# EAGLE design desk_winder (EAGLE 6.5.0)
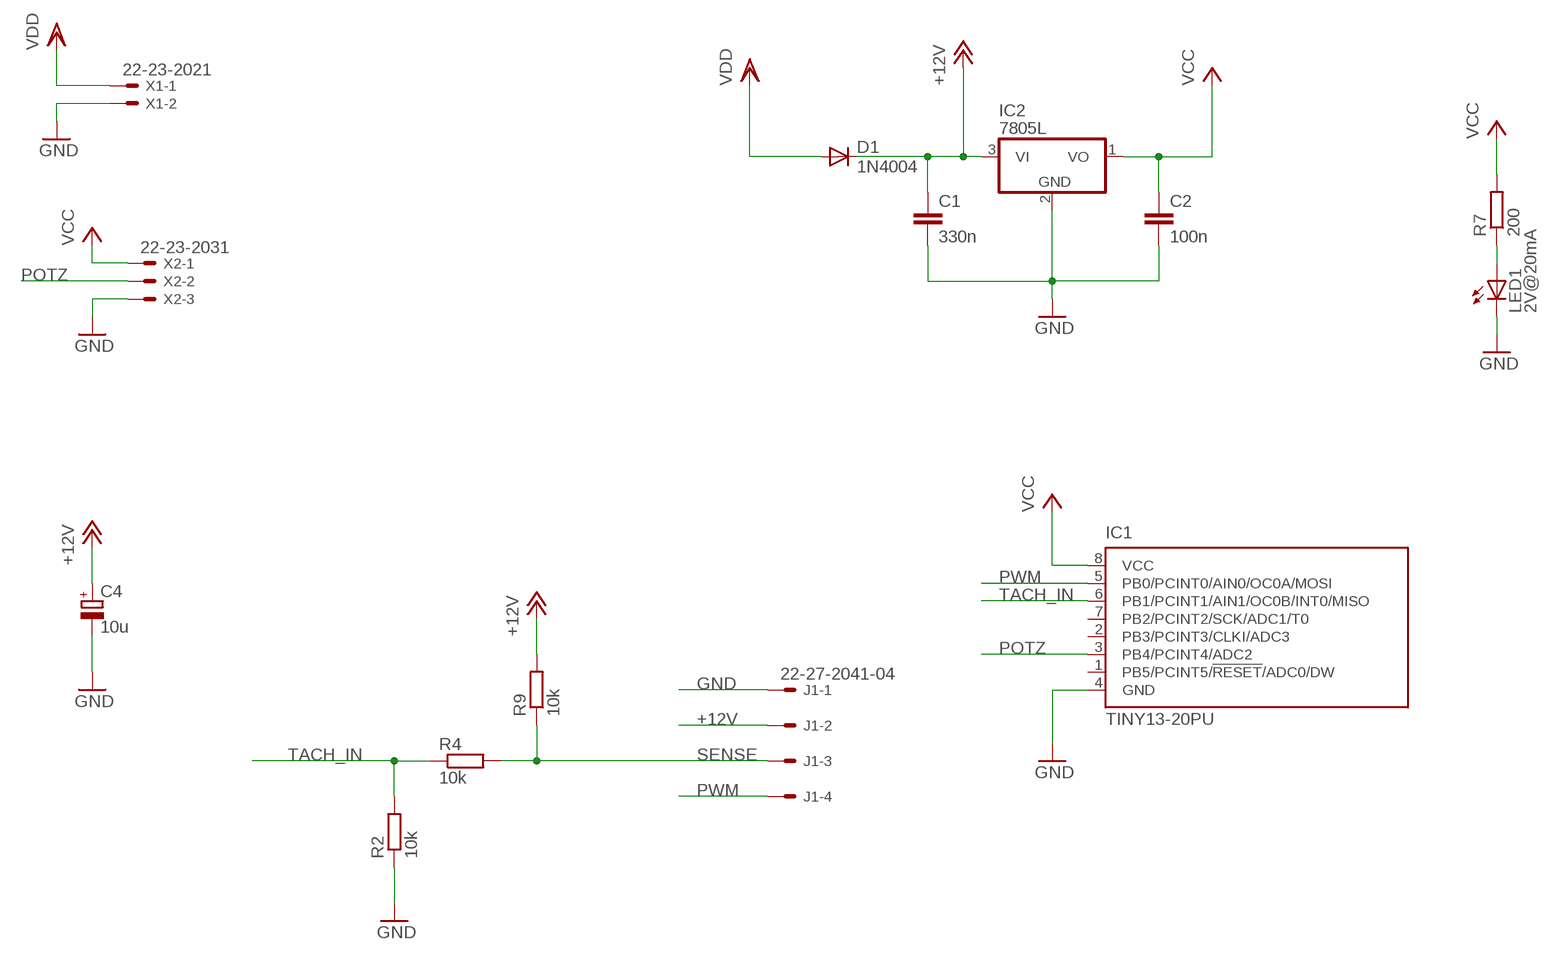
[diagram p0: schematic, sheet 1]

## Parts
C1  330n  C-EU050-025X075  [C050-025X075]
C2  100n  C-EU050-025X075  [C050-025X075]
C4  10u  CPOL-EUE2.5-6  [E2,5-6]
D1  1N4004  [DO41-10]
IC1  TINY13-20PU  [DIL08]
IC2  7805L  [TO92]
J1  22-27-2041-04  [6410-04]
LED1  2V@20mA  LED5MM  [LED5MM]
R2  10k  R-EU_0207/12  [0207/12]
R4  10k  R-EU_0207/12  [0207/12]
R7  200  R-EU_0207/12  [0207/12]
R9  10k  R-EU_0207/12  [0207/12]
X1  22-23-2021  [22-23-2021]
X2  22-23-2031  [22-23-2031]

## Nets
+12V [power]: C1.1 C4.+ D1.C IC2.3(VI) J1.2 R9.2
GND [power]: C1.2 C2.2 C4.- IC1.4(GND) IC2.2(GND) J1.1 LED1.K(C) R2.1 X1.2 X2.3
N$1: LED1.A R7.1
POTZ: IC1.3(PB4/PCINT4/ADC2) X2.2
PWM: IC1.5(PB0/PCINT0/AIN0/OC0A/MOSI) J1.4
SENSE: J1.3 R4.2 R9.1
TACH_IN: IC1.6(PB1/PCINT1/AIN1/OC0B/INT0/MISO) R2.2 R4.1
VCC: C2.1 IC1.8(VCC) IC2.1(VO) R7.2 X2.1
VDD [power]: D1.A X1.1
Unconnected: IC1.1(PB5/PCINT5/!RESET!/ADC0/DW) IC1.2(PB3/PCINT3/CLKI/ADC3) IC1.7(PB2/PCINT2/SCK/ADC1/T0)

## Library data of the parts
C1 C2 = rcl:C-EU: CAPACITOR, European symbol
C4 = rcl:CPOL-EU: POLARIZED CAPACITOR, European symbol
D1 = diode:1N4004: DIODE general purpose rectifier, 1 A
IC1 = atmel:TINY13: 8-bit AVR Microcontroller with 1K Bytes In-System Programmable Flash Source: http://www.atmel.com/dyn/resources/prod_documents/2535S.pdf; MPN: ATTINY13-20PU; OC_FARNELL: 9171550; OC_NEWARK: 96K6521
IC2 = linear:78*: Positive VOLTAGE REGULATOR Source: http://cache.national.com/ds/LM/LM78L05.pdf http://www.fairchildsemi.com/ds/LM/LM7805.pdf
J1 = con-molex:22-?-04: CONNECTOR wire to board 2.54 mm (.1 inch) pitch header; OC_FARNELL: unknown; OC_NEWARK: unknown
LED1 = led:LED: LED OSRAM: - CHIPLED LG R971, LG N971, LY N971, LG Q971, LY Q971, LO R971, LY R971 LH N974, LH R974 LS Q976, LO Q976, LY Q976 LO Q996 - Hyper CHIPLED LW Q18S LB Q993, LB Q99A, LB R99A - SideLED LS A670, LO A670, LY A670, LG A670, LP A670 LB A673, LV A673, LT A673, LW A673 LH A674 LY A675 LS A676, LA A676, LO A676, LY A676, LW A676 LS A679, LY A679, LG A679 - Hyper Micro SIDELED® LS Y876, LA Y876, LO Y876, LY Y876 LT Y87S - SmartLED LW L88C, LW L88S LB L89C, LB L89S, LG L890 LS L89K, LO L89K, LY L89K LS L896, LA L896, LO L896, LY L896 - TOPLED LS T670, LO T670, LY T670, LG T670, LP T670 LSG T670, LSP T670, LSY T670, LOP T670, LYG T670 LG T671, LOG T671, LSG T671 LB T673, LV T673, LT T673, LW T673 LH T674 LS T676, LA T676, LO T676, LY T676, LB T676, LH T676, LSB T676, LW T676 LB T67C, LV T67C, LT T67C, LS T67K, LO T67K, LY T67K, LW E67C LS E67B, LA E67B, LO E67B, LY E67B, LB E67C, LV E67C, LT E67C LW T67C LS T679, LY T679, LG T679 LS T770, LO T770, LY T770, LG T770, LP T770 LB T773, LV T773, LT T773, LW T773 LH T774 LS E675, LA E675, LY E675, LS T675 LS T776, LA T776, LO T776, LY T776, LB T776 LHGB T686 LT T68C, LB T68C - Hyper Mini TOPLED® LB M676 - Mini TOPLED Santana® LG M470 LS M47K, LO M47K, LY M47K Source: http://www.osram.convergy.de LUXEON: - LUMILED® LXK2-PW12-R00, LXK2-PW12-S00, LXK2-PW14-U00, LXK2-PW14-V00 LXK2-PM12-R00, LXK2-PM12-S00, LXK2-PM14-U00 LXK2-PE12-Q00, LXK2-PE12-R00, LXK2-PE12-S00, LXK2-PE14-T00, LXK2-PE14-U00 LXK2-PB12-K00, LXK2-PB12-L00, LXK2-PB12-M00, LXK2-PB14-N00, LXK2-PB14-P00, LXK2-PB14-Q00 LXK2-PR12-L00, LXK2-PR12-M00, LXK2-PR14-Q00, LXK2-PR14-R00 LXK2-PD12-Q00, LXK2-PD12-R00, LXK2-PD12-S00 LXK2-PH12-R00, LXK2-PH12-S00 LXK2-PL12-P00, LXK2-PL12-Q00, LXK2-PL12-R00 Source: www.luxeon.com KINGBRIGHT: KA-3528ASYC Source: www.kingbright.com
R2 R4 R7 R9 = resistor:R-EU_: RESISTOR, European symbol
X1 = con-molex:22-23-2021: .100" (2.54mm) Center Header - 2 Pin; MF: MOLEX; MPN: 22-23-2021; OC_FARNELL: 1462926; OC_NEWARK: 25C3832
X2 = con-molex:22-23-2031: .100" (2.54mm) Center Header - 3 Pin; MF: MOLEX; MPN: 22-23-2031; OC_FARNELL: 1462950; OC_NEWARK: 30C0862

## Net classes
0 default: width 0.406 mm
1 power: width 1.143 mm

## Board
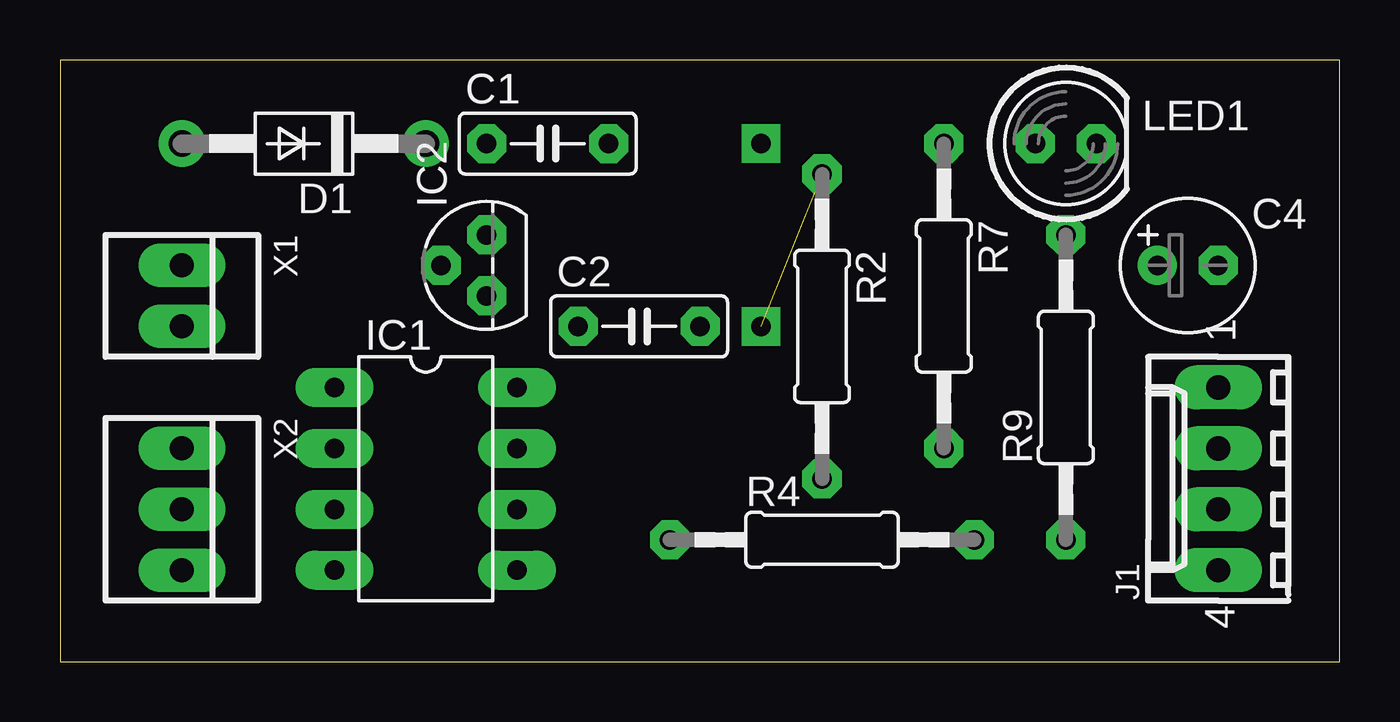
[diagram p1: board, top side]
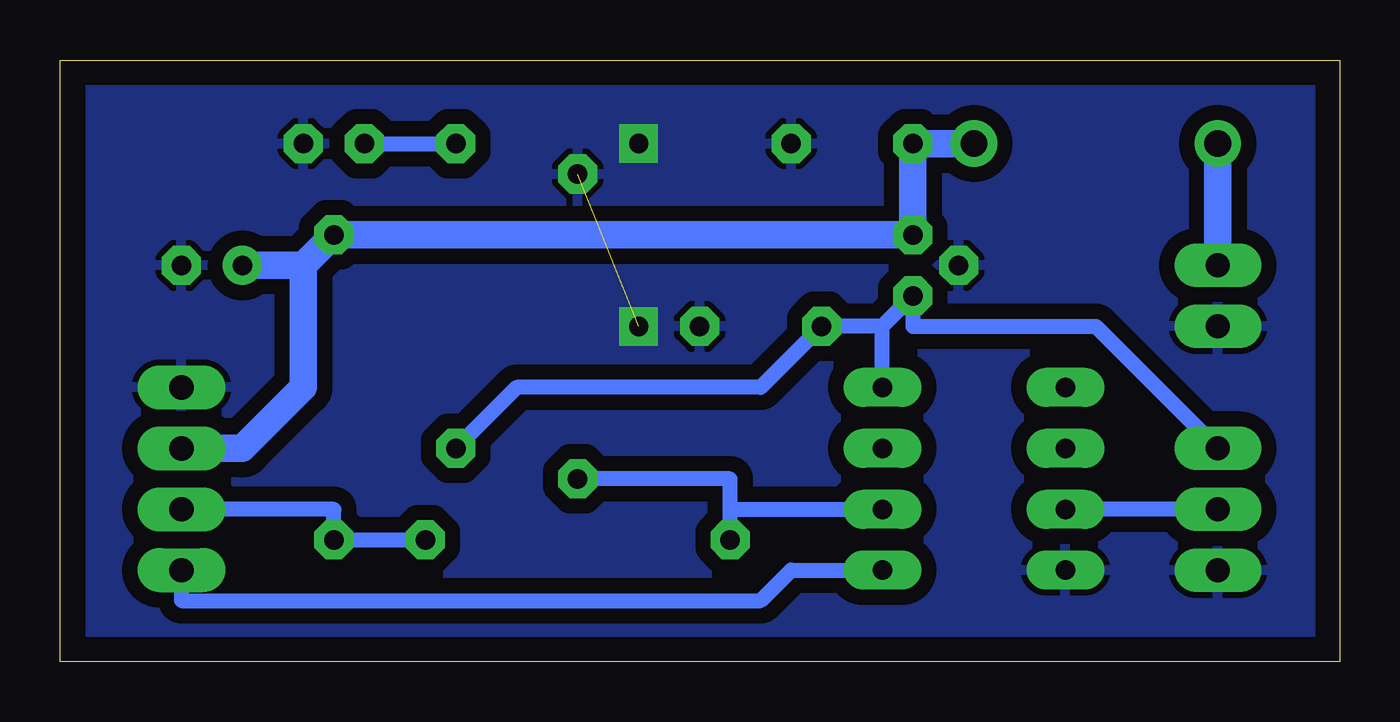
[diagram p2: board, bottom side, seen from below]

Size 53.32 x 25.07 mm. Coordinates in mm from the lower left corner, seen from the top.
Outline: 0,0 53.32,0 53.32,25.07 0,25.07 0,0
Copper layers (1*16): Top 0.035mm / dielectric 1.5mm / Bottom 0.035mm
Design rules "homepcb *": minimum track width 25mil, minimum drill 0.7mm, track to track 25mil, track to pad 25mil, pad to pad 20mil, via to via 10mil, smd to smd 10mil, copper to edge 40mil, drill to drill 10mil, minimum pad ring 16mil, minimum via ring 16mil, stop-mask expansion 0mil, vias tented up to drill 0mil, thermal gap 10mil

### Footprints (pad centres in the part's own frame; a part is rotated, then mirrored left to right if it is on the bottom)
C050-025X075 = drill 0.813 octagon: 1 -2.54,0; 2 2.54,0
E2,5-6 = drill 0.813 pad 1.6: + -1.27,0 | drill 0.813 pad 1.6 octagon: - 1.27,0
DO41-10 = drill 1.118: A 5.08,0; C -5.08,0
DIL08 = drill 0.813 long: 1 -3.81,-3.81; 2 -1.27,-3.81; 3 1.27,-3.81; 4 3.81,-3.81; 5 3.81,3.81; 6 1.27,3.81; 7 -1.27,3.81; 8 -3.81,3.81
TO92 = drill 0.813 octagon: 1 -1.27,0; 2 0,1.905; 3 1.27,0
6410-04 = drill 1.016 long: 1 3.81,0; 2 1.27,0; 3 -1.27,0; 4 -3.81,0
LED5MM = drill 0.813 octagon: A -1.27,0; K 1.27,0
0207/12 = drill 0.813 octagon: 1 -6.35,0; 2 6.35,0
22-23-2021 = drill 1 long: 1 -1.27,0; 2 1.27,0
22-23-2031 = drill 1 long: 1 -2.54,0; 2 0,0; 3 2.54,0

### Placement (x,y rotation side)
C1  20.32,21.59 0 top
C2  24.13,13.97 0 top
C4  46.99,16.51 0 top
D1  10.16,21.59 180 top
IC1  15.24,7.62 270 top
IC2  17.78,16.51 90 top
J1  48.26,7.62 90 top
LED1  41.91,21.59 0 top
R2  31.75,13.97 270 top
R4  31.75,5.08 0 top
R7  36.83,15.24 270 top
R9  41.91,11.43 90 top
X1  5.08,15.24 270 top
X2  5.08,6.35 270 top

### Tracks (layer width: path | path; a pad name or v marks a point on that pad's centre or on a via)
+12V
  Bottom 1.143: 43.18,16.51 R9.2 IC2.3 C1.1 D1.C | 43.18,16.51 C4.+ | 43.18,16.51 43.18,11.43 45.72,8.89 J1.2
GND  (via drill 0.8)  (1 unrouted)
  Bottom 1.143: IC1.4
  other vias: 29.21,21.59 29.21,13.97
  pour Bottom: 0,0 0,24.13 52.07,24.13 52.07,0
N$1
  Bottom 0.635: LED1.A R7.1
POTZ
  Bottom 0.635: X2.2 IC1.3
PWM
  Bottom 0.635: IC1.5 22.86,3.81 24.13,2.54 48.26,2.54 J1.4
SENSE
  Bottom 0.635: R4.2 R9.1 41.91,6.35 J1.3
TACH_IN
  Bottom 0.635: 25.4,6.35 IC1.6 | R4.1 25.4,6.35 | R2.2 25.4,7.62 25.4,6.35
VCC
  Bottom 0.635: R7.2 34.29,11.43 24.13,11.43 C2.1 19.05,13.97 | 19.05,13.97 IC2.1 17.78,13.97 10.16,13.97 X2.1 | IC1.8 19.05,13.97
VDD
  Bottom 1.143: D1.A X1.1